# EAGLE schematic esquema_eletrico_eagle (EAGLE 9.7.0)
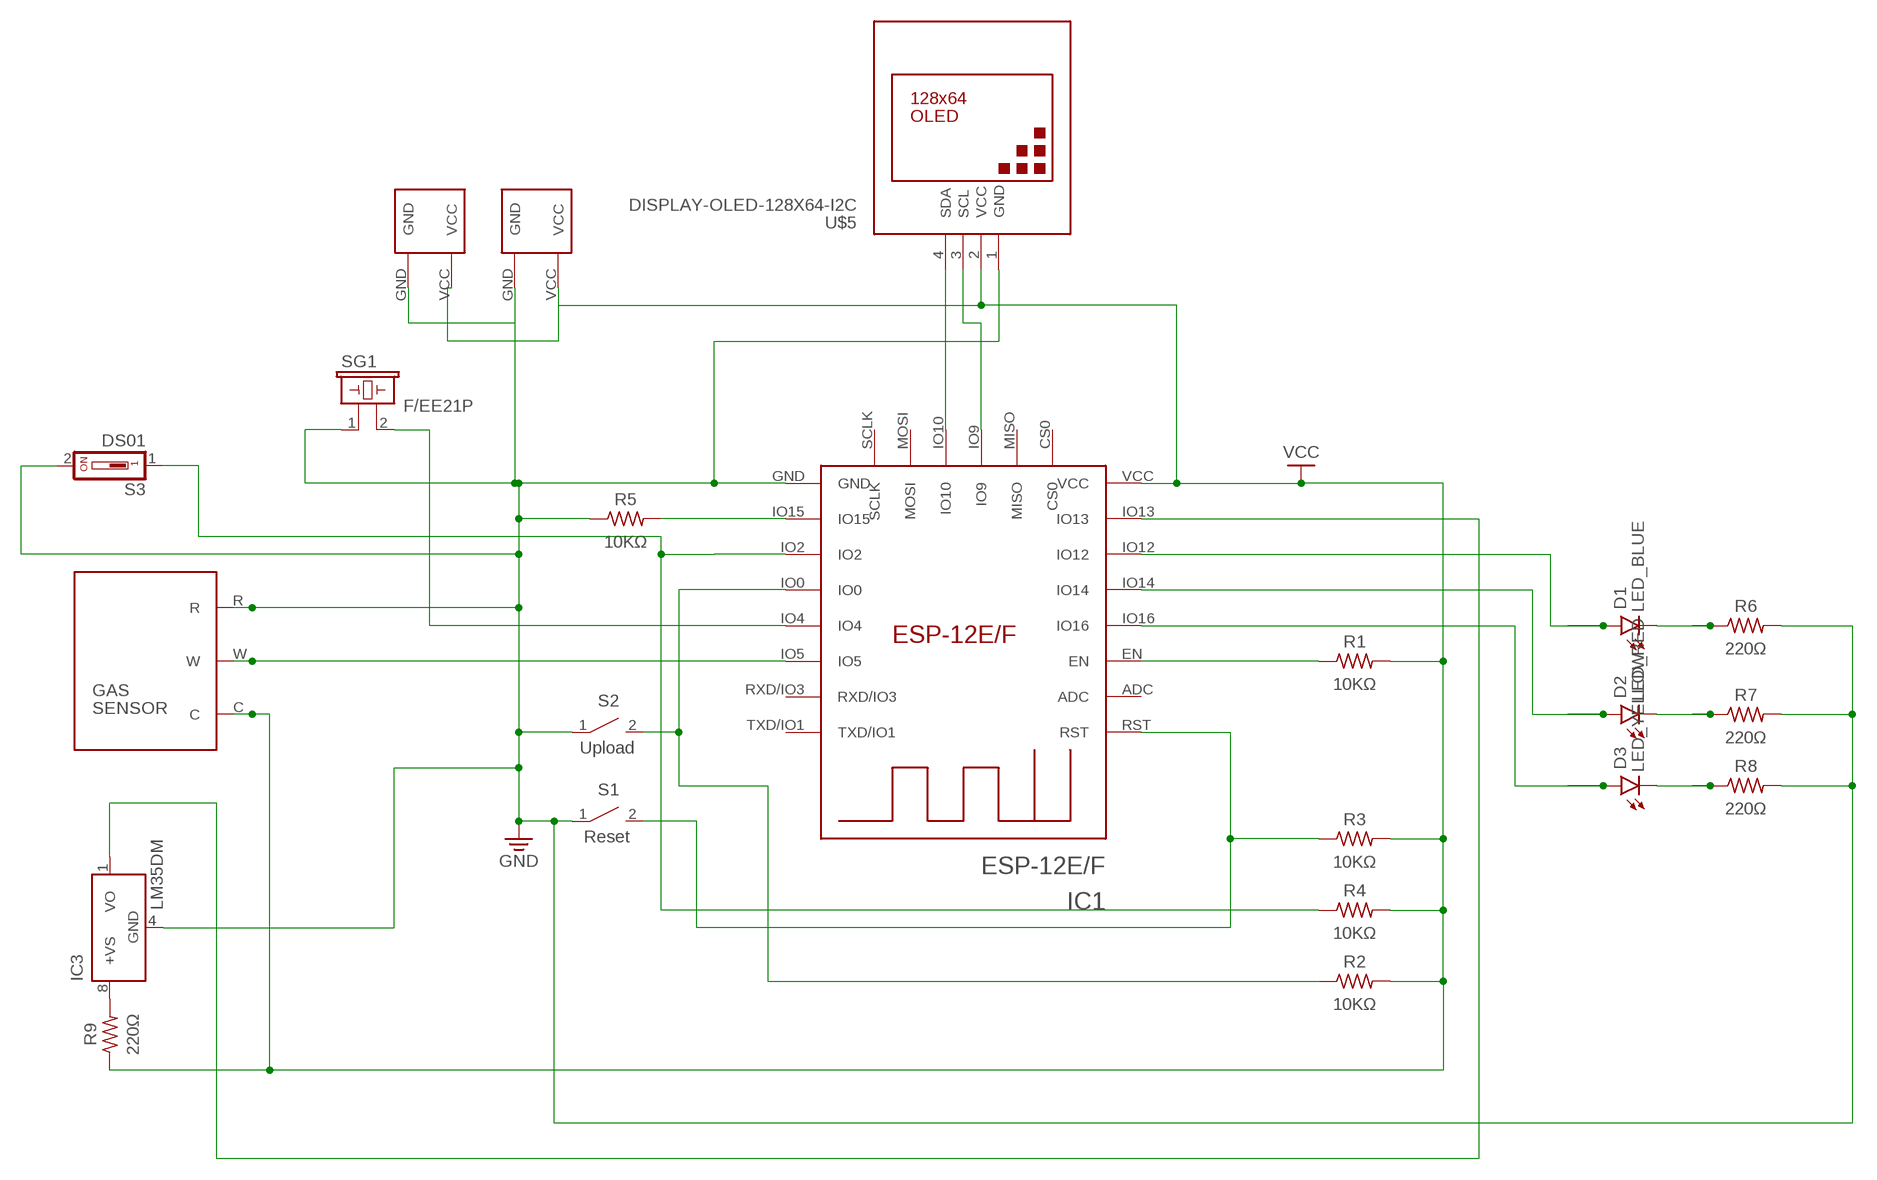
[diagram p0: schematic, sheet 1]

## Parts
D1  LED_BLUE  LED_RADIAL_BLUE  [LEDRD254W60D565H860B_B]
D2  LED_RED  LED_RADIAL_RED  [LEDRD254W60D565H860B]
D3  LED_YELLOW  LED_RADIAL_YELLOW  [LEDRD254W60D565H860B_Y]
IC1  ESP-12E/F  [ESP-12E]
IC3  LM35DM  [SO08]
R1  10KΩ  R-US_AXIAL-7.2MM-PITCH  [RESAD724W46L381D178B]
R2  10KΩ  R-US_AXIAL-7.2MM-PITCH  [RESAD724W46L381D178B]
R3  10KΩ  R-US_AXIAL-7.2MM-PITCH  [RESAD724W46L381D178B]
R4  10KΩ  R-US_AXIAL-7.2MM-PITCH  [RESAD724W46L381D178B]
R5  10KΩ  R-US_AXIAL-7.2MM-PITCH  [RESAD724W46L381D178B]
R6  220Ω  R-US_AXIAL-7.2MM-PITCH  [RESAD724W46L381D178B]
R7  220Ω  R-US_AXIAL-7.2MM-PITCH  [RESAD724W46L381D178B]
R8  220Ω  R-US_AXIAL-7.2MM-PITCH  [RESAD724W46L381D178B]
R9  220Ω  R-US_AXIAL-7.2MM-PITCH  [RESAD724W46L381D178B]
S1  Reset  B3U-X000B3U-1000P(M)-B1000P(M)-B  [B3U-1000P(M)-B]
S2  Upload  B3U-X000B3U-1000P(M)-B1000P(M)-B  [B3U-1000P(M)-B]
S3  DS01  [DS-01]
SG1  F/EE21P  [F/EE21P]
U$1  CR2032  [CR2032-20MM]
U$2  3-ELECTRODE-GAS-SENSOR  [3-ELECTRODE]
U$3  CR2032  [CR2032-20MM]
U$5  DISPLAY-OLED-128X64-I2C  [DISPLAY-OLED-128X64-I2C]

## Nets
GND: IC1.GND IC3.4(GND) R5.1 R6.2 R7.2 R8.2 S1.1 S2.1 S3.2 SG1.1 U$1.GND U$2.R U$3.GND U$5.1(GND)
N$1: IC1.RST R3.1 S1.2
N$2: IC1.IO15 R5.2
N$3: IC1.EN R1.1
N$4: IC1.IO2 R4.1 S3.1
N$5: IC1.IO0 R2.1 S2.2
N$6: IC1.IO4 SG1.2
N$7: IC1.IO5 U$2.W
N$8: IC1.IO13 IC3.1(VO)
N$9: D1.1(A) IC1.IO12
N$10: D2.1(A) IC1.IO14
N$11: D3.1(A) IC1.IO16
N$12: D1.2(C) R6.1
N$13: D2.2(C) R7.1
N$14: D3.2(C) R8.1
N$15: IC3.8(+VS) R9.2
N$16: IC1.IO10 U$5.4(SDA)
N$17: IC1.IO9 U$5.3(SCL)
VCC: IC1.VCC R1.2 R2.2 R3.2 R4.2 R9.1 U$1.VCC U$2.C U$3.VCC U$5.2(VCC)
Unconnected: IC1.ADC IC1.CS0 IC1.MISO IC1.MOSI IC1.RXD/IO3 IC1.SCLK IC1.TXD/IO1

## Library data of the parts
D1-D3 = Opto-Electronic:LED_RADIAL: LED - Generic; CATEGORY: Opto-Electronic; SUB-CATEGORY: LED
IC1 = esp-12e-f:ESP-12E/F
IC3 = lm351:LM35: Single-Supply Centigrade Temperature Sensor Vout = (10mV/°C x Temp °C) +5mmmV Source: http://www.national.com/ds/LM/LM35.pdf
R1-R9 = Resistor:R-US: Resistor Fixed - ANSI; CATEGORY: Resistor; SUB-CATEGORY: Fixed
S1 S2 = Switch:B3U-X000: Ultra-small Tactile Switch Contact form : SPST-NO Datasheet <https://omronfs.omron.com/en_US/ecb/products/pdf/en-b3u.pdf>; CATEGORY: Switch; DESCRIPTION: Ultra-small Surface-mounting Tactile Switches with High Contact Reliability; MANUFACTURER: OMRON; OPERATING_TEMPERATURE: -25°C to +70°C at 60%RH max; PART_STATUS: ACTIVE; ROHS_COMPLIANCE: RoHS Compliant; SERIES: B3U; TYPE: Tactile; VALUE: B3U-1000P(M)-B
S3 = Switch:DS01: DIL/CODE SWITCH; CATEGORY: SWITCH; TYPE: SPST
SG1 = buzzer:F/EE21P: BUZZER Source: Buerklin
U$1 U$3 = cr20323:CR2032
U$2 = senso_gas1:3-ELECTRODE-GAS-SENSOR: 3 electrode electrochemical CO sensor; MANUFACTURER: Wearnes Cambion; MANUFACTURER#: 450-3326; QTY-PER-DEVICE: 3
U$5 = oled:DISPLAY-OLED-128X64-I2C: 128x64 Dot Matrix OLED Module based on SSD1306 chip Variant with I2C interface More details available here: http://www.instructables.com/id/Monochrome-096-i2c-OLED-display-with-arduino-SSD13/ SSD1306 datasheet: https://cdn-shop.adafruit.com/datasheets/SSD1306.pdf Click here to find device on ebay.com <http://www.ebay.com/sch/oled+display+128x64+iic> Note: There are two variants: I2C and SPI. Search for the proper version.